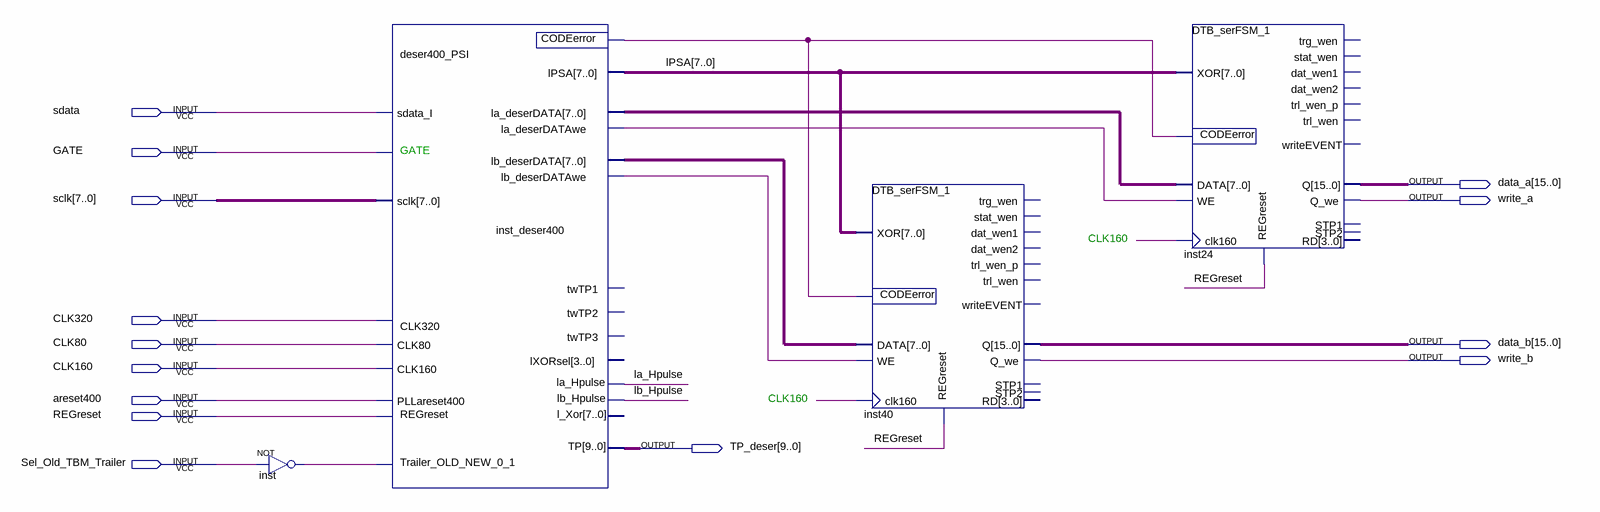
[diagram p0: schematic sheet]
// Quartus schematic deser400_top.bdf as structural Verilog: 4 symbols, 14 pins
module deser400_top (
  input  sdata,
  input  GATE,
  input  [7:0] sclk,
  input  CLK320,
  input  CLK80,
  input  CLK160,
  input  areset400,
  input  REGreset,
  input  Sel_Old_TBM_Trailer,
  output [15:0] data_a,
  output write_a,
  output [15:0] data_b,
  output write_b,
  output [9:0] TP_deser
);

  wire inst_deser400_codeerror, inst_deser400_la_deserdatawe, inst_deser400_lb_deserdatawe, inst_out,
       la_Hpulse, lb_Hpulse;
  wire [7:0] inst_deser400_la_deserdata, inst_deser400_lb_deserdata, lPSA;

  not inst (inst_out, Sel_Old_TBM_Trailer);
  deser400_PSI inst_deser400 (
    .sdata_I(sdata), .PLLareset400(areset400), .CLK160(CLK160), .GATE(GATE), .REGreset(REGreset),
    .Trailer_OLD_NEW_0_1(inst_out), .sclk(sclk), .CLK80(CLK80), .CLK320(CLK320),
    .la_deserDATA(inst_deser400_la_deserdata), .la_deserDATAwe(inst_deser400_la_deserdatawe), .lPSA(lPSA),
    .lb_deserDATA(inst_deser400_lb_deserdata), .lb_deserDATAwe(inst_deser400_lb_deserdatawe),
    .la_Hpulse(la_Hpulse), .lb_Hpulse(lb_Hpulse), .CODEerror(inst_deser400_codeerror), .TP(TP_deser));  // open: twTP1, lXORsel, twTP2, twTP3, l_Xor
  DTB_serFSM_1 inst40 (
    .clk160(CLK160), .DATA(inst_deser400_lb_deserdata), .XOR(lPSA), .WE(inst_deser400_lb_deserdatawe),
    .REGreset(REGreset), .CODEerror(inst_deser400_codeerror), .Q(data_b), .Q_we(write_b));  // open: trg_wen, stat_wen, writeEVENT, dat_wen1, RD, STP1, STP2, dat_wen2, trl_wen_p, trl_wen
  DTB_serFSM_1 inst24 (
    .clk160(CLK160), .DATA(inst_deser400_la_deserdata), .XOR(lPSA), .WE(inst_deser400_la_deserdatawe),
    .REGreset(REGreset), .CODEerror(inst_deser400_codeerror), .Q(data_a), .Q_we(write_a));  // open: trg_wen, stat_wen, writeEVENT, dat_wen1, RD, STP1, STP2, dat_wen2, trl_wen_p, trl_wen
endmodule
